# EAGLE schematic Horizontally_Mounted_Lighthouse_V16 (EAGLE 9.4.2)
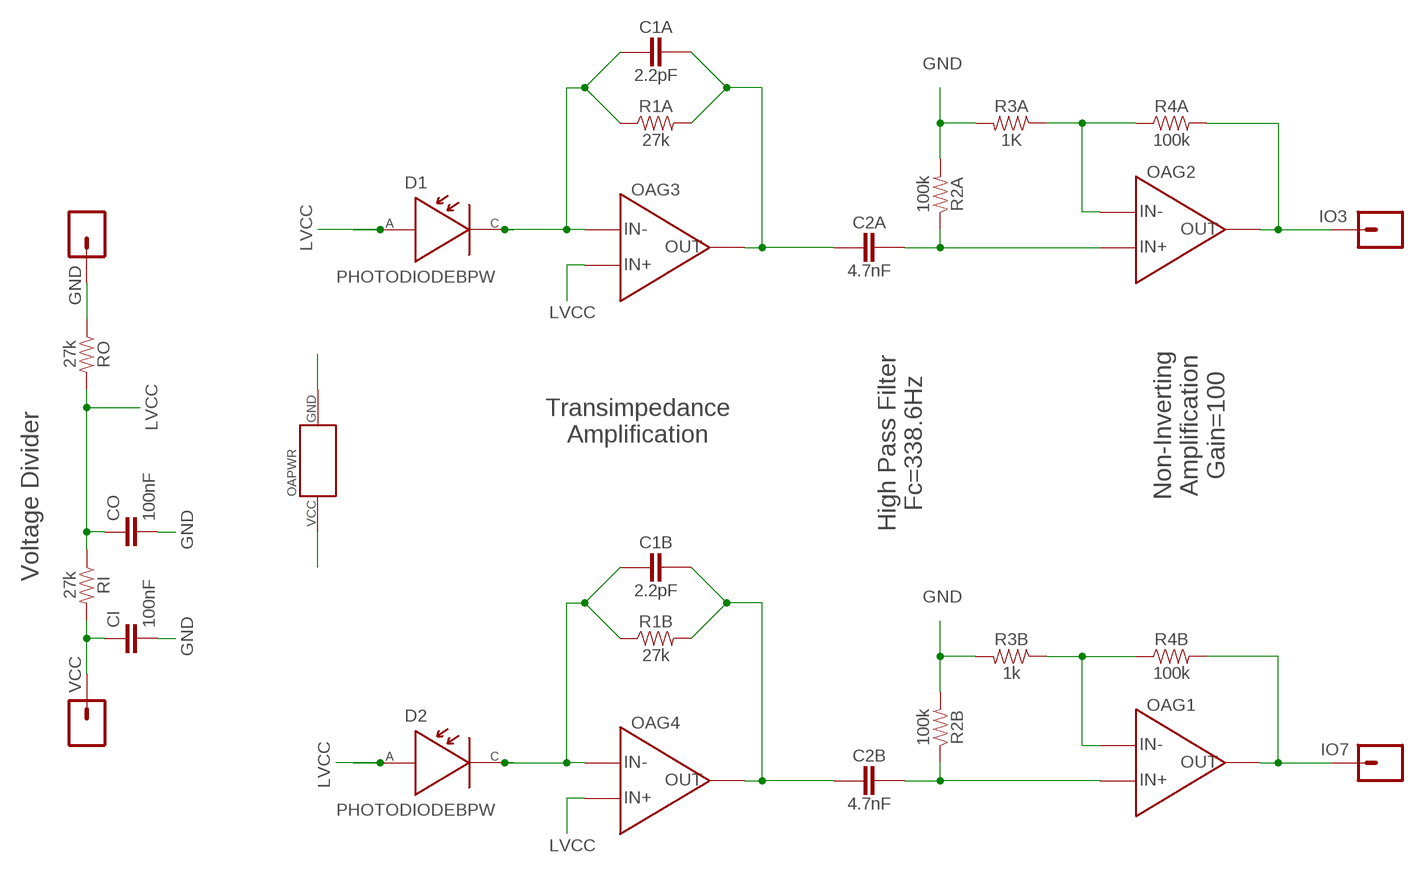
[diagram p0: schematic, sheet 1]

## Parts
C1A  2.2pF  CAPACITOR  [PASSIVE-0603]
C1B  2.2pF  CAPACITOR  [PASSIVE-0603]
C2A  4.7nF  CAPACITOR  [PASSIVE-0603]
C2B  4.7nF  CAPACITOR  [PASSIVE-0603]
CI  100nF  4.7PF-0603-50V-5%  [0603]
CO  100nF  4.7PF-0603-50V-5%  [0603]
D1  PHOTODIODEBPW  [BPW34_BP104_SMD]
D2  PHOTODIODEBPW  [BPW34_BP104_SMD]
GND  CONN_01PTH_NO_SILK_YES_STOP  [1X01_NO_SILK]
IO3  CONN_01PTH_NO_SILK_YES_STOP  [1X01_NO_SILK]
IO7  CONN_01PTH_NO_SILK_YES_STOP  [1X01_NO_SILK]
OA  TLV2464IDM  [D14-M]
R1A  27k  RESISTOR  [PASSIVE-0603]
R1B  27k  RESISTOR  [PASSIVE-0603]
R2A  100k  RESISTOR  [PASSIVE-0603]
R2B  100k  RESISTOR  [PASSIVE-0603]
R3A  1K  RESISTOR  [PASSIVE-0603]
R3B  1k  RESISTOR  [PASSIVE-0603]
R4A  100k  RESISTOR  [PASSIVE-0603]
R4B  100k  RESISTOR  [PASSIVE-0603]
RI  27k  100KOHM-0603-1/10W-1%  [0603]
RO  27k  100KOHM-0603-1/10W-1%  [0603]
VCC  CONN_01PTH_NO_SILK_YES_STOP  [1X01_NO_SILK]

## Nets
D1IN: C1B.1 D2.CATHODE OA.13(IN-) R1B.1
D1OA2P: C2B.2 OA.3(IN+) R2B.1
D1OAOUT1: C1B.2 C2B.1 OA.14(OUT) R1B.2
D2IN: C1A.1 D1.CATHODE OA.9(IN-) R1A.1
D2OA1OUT: C1A.2 C2A.1 OA.8(OUT) R1A.2
D2OA2P: C2A.2 OA.5(IN+) R2A.1
GND: CI.2 CO.2 GND.1 OA.11(PWR:GND) R2A.2 R2B.2 R3A.2 R3B.2 RO.1
IO3: IO3.1 OA.7(OUT) R4A.2
IO7: IO7.1 OA.1(OUT) R4B.2
LVCC: CO.1 D1.ANODE D2.ANODE OA.10(IN+) OA.12(IN+) RI.1 RO.2
N$1: OA.6(IN-) R3A.1 R4A.1
N$11: OA.2(IN-) R3B.1 R4B.1
VCC: CI.1 OA.4(PWR:VCC) RI.2 VCC.1

## Notes on the sheet
- Non-Inverting
  Amplification
  Gain=100
- Transimpedance
  Amplification
- High Pass Filter
  Fc=338.6Hz
- Voltage Divider

## Library data of the parts
C1A C1B C2A C2B = ZippyComponentLibrary:CAPACITOR
CI CO = SparkFun-Capacitors:4.7PF: 4.7pF ceramic capacitors A capacitor is a passive two-terminal electrical component used to store electrical energy temporarily in an electric field.; PROD_ID: CAP-07880; VALUE: 4.7pF
D1 D2 = ZippyComponentLibrary:PHOTODIODE: "2x1 SMD Mounting Point For BPW34 Diode"
GND IO3 IO7 VCC = SparkFun-Connectors:CONN_01: Single connection point. Often used as Generic Header-pin footprint for 0.1 inch spaced/style header connections On any of the 0.1 inch spaced packages, you can populate with these: Break Away Headers - Straight <https://www.sparkfun.com/products/116> (PRT-00116) Break Away Male Headers - Right Angle <https://www.sparkfun.com/products/553> (PRT-00553) Female Headers <https://www.sparkfun.com/products/115> (PRT-00115) Break Away Headers - Machine Pin <https://www.sparkfun.com/products/117> (PRT-00117) Break Away Female Headers - Swiss Machine Pin <https://www.sparkfun.com/products/743> (PRT-00743) This device is also useful as a general connection point to wire up your design to another part of your project. Our various solder wires solder well into these plated through hole pads. Hook-Up Wire - Assortment (Stranded, 22 AWG) <https://www.sparkfun.com/products/11375> (PRT-11375) Hook-Up Wire - Assortment (Solid Core, 22 AWG) <https://www.sparkfun.com/products/11367> (PRT-11367) View the entire wire category on our website here <https://www.sparkfun.com/categories/141> Special notes: SMTSO-256-ET is a "flush mount" nut for a 4-40 screw. We mostly use this on specialty testbeds; it is a nice way to connect hardware to your PCB at an adjustable hieght. Also note, the SNAP packages are for using a snappable style connector. We sell a baggie of snaps and they are also used on two LilyPad designs: Snap Assortment - 30 pack (male and female) <https://www.sparkfun.com/products/11347> (DEV-11347) LilyPad Arduino SimpleSnap <https://www.sparkfun.com/products/10941> (DEV-10941) LilyPad SimpleSnap Protoboard <https://www.sparkfun.com/products/10940> (DEV-10940)
OA = ZippyComponentLibrary:TLV2464ID
R1A R1B R2A R2B R3A R3B R4A R4B = ZippyComponentLibrary:RESISTOR
RI RO = SparkFun-Resistors:100KOHM: 100kΩ resistor A resistor is a passive two-terminal electrical component that implements electrical resistance as a circuit element. Resistors act to reduce current flow, and, at the same time, act to lower voltage levels within circuits. - Wikipedia; PROD_ID: RES-07828; VALUE: 100k